# EasyEDA Pro project Type_C硬盘盒_2025-09-27_14-32-02.eprj, board PCB_ver2.0
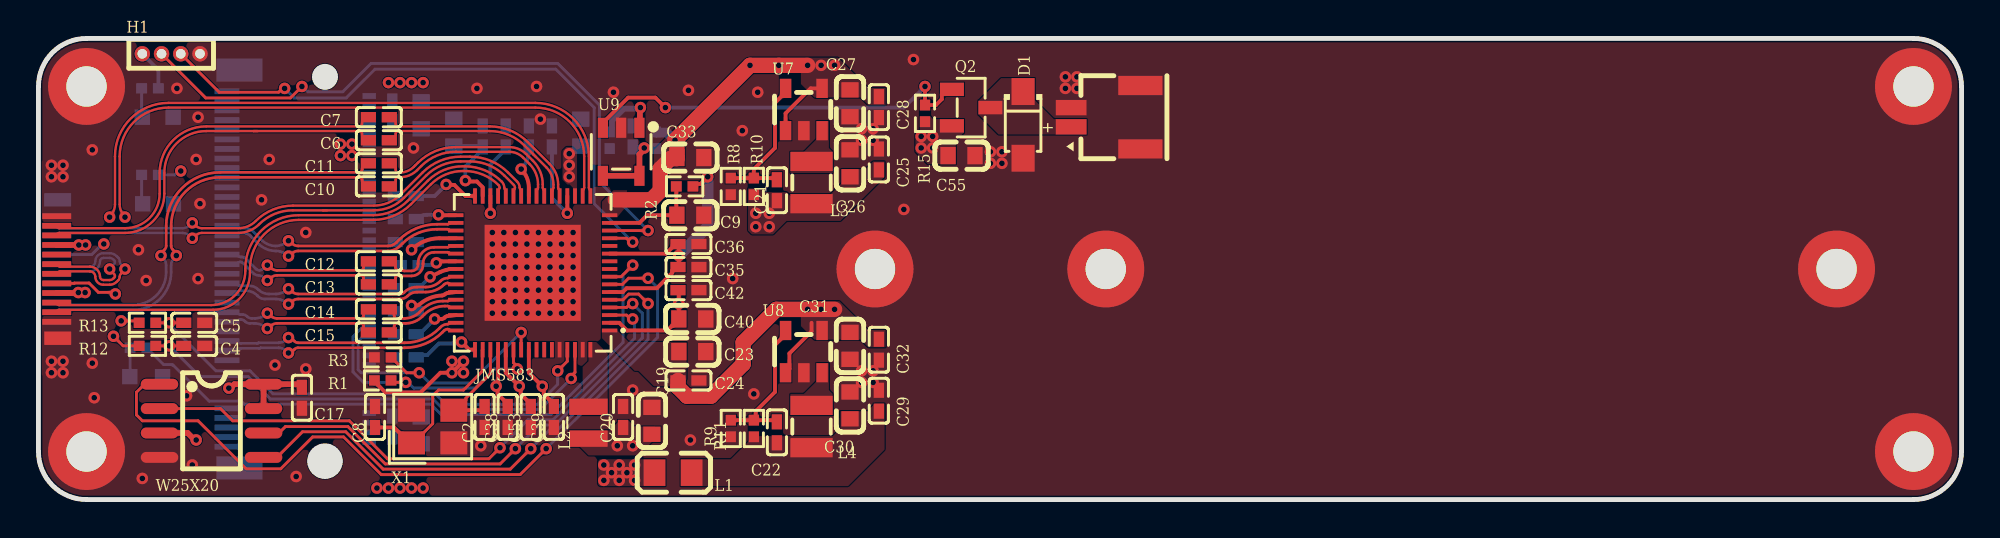
[diagram p5: board, top side]
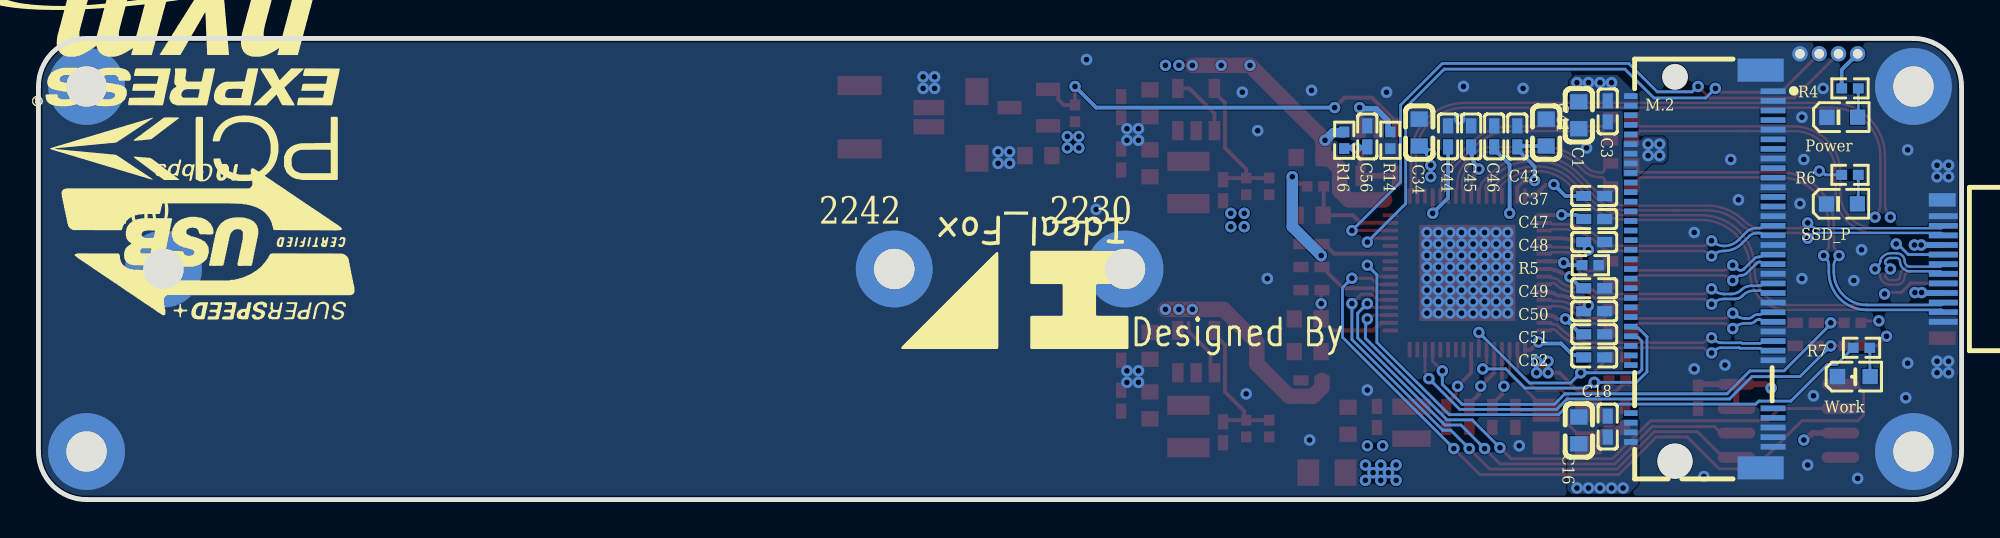
[diagram p6: board, bottom side, seen from below]

Outline 100 x 24 mm; copper layers: Top Layer, GND, VCC, Bottom Layer. Coordinates in mm from the lower left corner of the outline.
Outline path: 0,21.5 arc(0.73,23.27) 2.5,24 97.5,24 arc(99.27,23.27) 100,21.5 100,2.5 arc(99.27,0.73) 97.5,0 2.5,0 arc(0.73,0.73) 0,2.5 0,21.5
Stack: Top Layer 0.035mm / Dielectric 1 0.0711mm PP-006 er 4.1 / GND 0.018mm / Dielectric1 0.32mm FR-4 er 4.8 / VCC 0.018mm / Dielectric 2 0.0711mm PP-006 er 4.1 / Bottom Layer 0.035mm

## Design rules (mm)
net N_P1_TX_P: N_P1_TX
net N_P1_TX_N: N_P1_TX
net N_P0_TX_P: N_P0_TX
net N_P0_TX_N: N_P0_TX
net U_TX2_P: U_TX2
net U_TX2_N: U_TX2
net U_TX1_P: U_TX1
net U_TX1_N: U_TX1
net TX2_P: TX2
net TX2_N: TX2
net TX1_P: TX1
net TX1_N: TX1
net RX2_P: RX2
net RX2_N: RX2
net RX1_P: RX1
net RX1_N: RX1
net P1_TX_P: P1_TX
net P1_TX_N: P1_TX
net P1_RX_P: P1_RX
net P1_RX_N: P1_RX
net P0_TX_P: P0_TX
net P0_TX_N: P0_TX
net P0_RX_P: P0_RX
net P0_RX_N: P0_RX
net D_P: D
net D_N: D
net CLK_P: CLK
net CLK_N: CLK
spacing copperThickness2oz_1: track to track 0.12, other pairs 0 to 0.3
spacing copperThickness1oz_1: track to track 0.12, other pairs 0 to 0.3
spacing copperThickness1oz: track to track 0.12, other pairs 0 to 0.3
spacing Stitching GND: track to track 0.2, other pairs 0 to 0.3
spacing safeClearance (default): track to track 0.12, other pairs 0 to 0.3
track width copperThickness1oz_2 (default): min 0.1, default 0.1, max 5
differential pair DiffPairsRouting_85oum: width min 0.1, default 0.1, max 0.381; gap min 0.1, default 0.1
differential pair DiffPairsRouting_90oum (default): width min 0.1, default 0.1, max 0.381; gap min 0.1, default 0.1
via viaSize (default): diameter min 0.6, default 0.6, max 10; hole min 0.3, default 0.3, max 6.3
net GND uses Stitching GND

## Placement (name value [footprint] x y rotation side)
+  -  [CONN-SMD_2P-P1.00_HX-1.0-2P-WT]  55.5 19.9 90 top
C1  -  [C0603]  19.9 20 270 bottom
C2  -  [C0402]  23.2 4.3 90 top
C3  -  [C0402]  18.4 20.2 90 bottom
C4  -  [C0402]  8.1 8 0 top
C5  -  [C0402]  8.1 9.2 0 top
C6  -  [C0402]  17.7 18.7 0 top
C7  -  [C0402]  17.7 19.9 0 top
C8  -  [C0402]  17.5 4.3 270 top
C9  -  [C0603]  33.9 14.8 180 top
C10  -  [C0402]  17.7 16.3 0 top
C11  -  [C0402]  17.7 17.5 0 top
C12  -  [C0402]  17.7 12.4 180 top
C13  -  [C0402]  17.7 11.2 180 top
C14  -  [C0402]  17.7 9.9 180 top
C15  -  [C0402]  17.7 8.7 180 top
C16  -  [C0603]  19.9 3.6 90 bottom
C17  -  [C0402]  13.7 5.3 90 top
C18  -  [C0402]  18.4 3.8 270 bottom
C19  -  [C0603]  31.9 4.1 270 top
C20  -  [C0402]  30.4 4.3 270 top
C21  -  [C0402]  38.4 16.1 90 top
C22  -  [C0402]  38.4 3.5 90 top
C23  -  [C0603]  34 7.7 180 top
C24  -  [C0402]  33.8 6.2 180 top
C25  -  [C0402]  43.7 17.7 270 top
C26  -  [C0603]  42.2 17.5 270 top
C27  -  [C0603]  42.2 20.62 90 top
C28  -  [C0402]  43.7 20.42 90 top
C29  -  [C0402]  43.7 5.14 270 top
C30  -  [C0603]  42.2 4.9 270 top
C31  -  [C0603]  42.2 8 90 top
C32  -  [C0402]  43.7 7.8 90 top
C33  -  [C0603]  33.9 17.8 180 top
C34  -  [C0603]  28.2 19.1 270 bottom
C35  -  [C0402]  33.8 12.1 180 top
C36  -  [C0402]  33.8 13.3 180 top
C37  -  [C0402]  19.1 15.8 0 bottom
C38  -  [C0402]  24.4 4.3 90 top
C39  -  [C0402]  26.8 4.3 90 top
C40  -  [C0603]  34 9.4 180 top
C41  -  [C0603]  21.6 19.1 270 bottom
C42  -  [C0402]  33.8 10.9 180 top
C43  -  [C0402]  23.1 18.9 270 bottom
C44  -  [C0402]  26.7 18.9 270 bottom
C45  -  [C0402]  25.5 18.9 270 bottom
C46  -  [C0402]  24.3 18.9 270 bottom
C47  -  [C0402]  19.1 14.6 0 bottom
C48  -  [C0402]  19.1 13.4 0 bottom
C49  -  [C0402]  19.1 11 0 bottom
C50  -  [C0402]  19.1 9.8 0 bottom
C51  -  [C0402]  19.1 8.6 0 bottom
C52  -  [C0402]  19.1 7.4 0 bottom
C53  -  [C0402]  25.6 4.3 90 top
C55  -  [C0603]  48 17.9 180 top
C56  -  [C0402]  30.9 18.9 90 bottom
D1  -  [SOD-123FL_L2.7-W1.8-LS3.8-RD]  51.2 19.5 270 top
Designator10  -  [M2_HOLE]  2.5 21.5 0 top
Designator12  -  [M2_HOLE]  43.5 12 0 top
Designator13  -  [M2_HOLE]  55.5 12 0 top
Designator17  -  [M2_HOLE]  97.5 21.5 0 top
Designator18  -  [M2_HOLE]  93.5 12 0 top
Designator19  -  [M2_HOLE]  97.5 2.5 0 top
Designator20  -  [M2_HOLE]  2.5 2.5 0 top
H1  -  [HDR-TH_ZX-PZ1.0-1-4PZZ]  6.9 23.2 0 top
JMS583  -  [QFN-64_L8.0-W8.0-P0.40-TL-EP6.0]  25.7 11.8 180 top
L1  -  [L0805]  33 1.4 180 top
L2  -  [IND-SMD_L2.5-W2.0-VLS252012CX-150M]  28.6 4 90 top
L3  -  [IND-SMD_L2.5-W2.0_MHCHL2520]  40.2 16.5 90 top
L4  -  [IND-SMD_L2.5-W2.0_MHCHL2520]  40.2 3.8 90 top
M.2  -  [CONN-SMD_91302-225-067RCM]  13.5 12 270 bottom
Power  -  [LED0603-RD_GREEN]  6.2 19.9 180 bottom
Q2  -  [SOT-23-3_L2.9-W1.3-P1.90-LS2.4-BR]  48.5 20.4 180 top
R1  -  [R0402]  17.9 6.2 180 top
R2  -  [R0402]  33.6 16.3 180 top
R3  -  [R0402]  17.9 7.4 180 top
R4  -  [R0402]  5.8 21.4 180 bottom
R5  -  [R0402]  19.3 12.2 180 bottom
R6  -  [R0402]  5.8 16.9 180 bottom
R7  -  [R0402]  5.2 7.9 180 bottom
R8  -  [R0402]  36 16.3 90 top
R9  -  [R0402]  36 3.7 90 top
R10  -  [R0402]  37.2 16.3 270 top
R11  -  [R0402]  37.2 3.7 270 top
R12  -  [R0402]  5.67 8 0 top
R13  -  [R0402]  5.67 9.2 0 top
R14  -  [R0402]  29.7 18.7 90 bottom
R15  -  [R0402]  46.1 20.1 90 top
R16  -  [R0402]  32.1 18.7 270 bottom
SSD_P  -  [LED0603-RD_GREEN]  6.22 15.39 180 bottom
U7  -  [SOT-23-5_L2.9-W1.6-P0.95-LS2.8-BL]  39.8 20.3 0 top
U8  -  [SOT-23-5_L2.9-W1.6-P0.95-LS2.8-BL]  39.8 7.7 0 top
U9  -  [SOT-23-5_L3.0-W1.5-P0.95-LS2.8-BL]  30.3 18.1 180 top
USB1  -  [USB-TYPE-C-SMD_U261-241N-4BS60]  0.97 12 90 bottom
W25X20  -  [SOIC-8_L5.0-W4.0-P1.27-LS6.0-BL]  9 4.1 270 top
Work  -  [LED0603-R-RD]  5.6 6.4 180 bottom
X1  -  [CRYSTAL-SMD_4P-L3.2-W2.5-BL]  20.5 3.8 0 top

## Footprints (pads in the part's own frame, mm; a bottom-side part is the same pattern mirrored in y, then rotated)
C0402
  rect 0.79x0.54 smd: 1(-0.545,0) 2(0.545,0)
C0603
  rect 0.8x0.9 smd: 1(-0.7,0) 2(0.7,0)
CONN-SMD_2P-P1.00_HX-1.0-2P-WT
  rect 0.8x1.6 smd: 1(-0.5,1.8) 2(0.5,1.8)
  rect 1x2.3 smd: 3(1.65,-1.8) 4(-1.65,-1.8)
CONN-SMD_91302-225-067RCM
  rect 0.3x1.3 smd: 1(-9.25,3.7) 3(-8.75,3.7) 5(-8.25,3.7) 7(-7.75,3.7) 9(-7.25,3.7) 11(-6.75,3.7) 13(-6.25,3.7) 15(-5.75,3.7) 17(-5.25,3.7) 19(-4.75,3.7) 21(-4.25,3.7) 23(-3.75,3.7) 25(-3.25,3.7) 27(-2.75,3.7) 29(-2.25,3.7) 31(-1.75,3.7) 33(-1.25,3.7) 35(-0.75,3.7) 37(-0.25,3.7) 39(0.25,3.7) 41(0.75,3.7) 43(1.25,3.7) 45(1.75,3.7) 47(2.25,3.7) 49(2.75,3.7) 51(3.25,3.7) 53(3.75,3.7) 55(4.25,3.7) 57(4.75,3.7) 67(7.25,3.7) 69(7.75,3.7) 71(8.25,3.7) 73(8.75,3.7) 75(9.25,3.7)
  rect 0.3x0.7 smd: 2(-9,-3.7) 4(-8.5,-3.7) 6(-8,-3.7) 8(-7.5,-3.7) 10(-7,-3.7) 12(-6.5,-3.7) 14(-6,-3.7) 16(-5.5,-3.7) 18(-5,-3.7) 20(-4.5,-3.7) 22(-4,-3.7) 24(-3.5,-3.7) 26(-3,-3.7) 28(-2.5,-3.7) 30(-2,-3.7) 32(-1.5,-3.7) 34(-1,-3.7) 36(-0.5,-3.7) 38(0,-3.7) 40(0.5,-3.7) 42(1,-3.7) 44(1.5,-3.7) 46(2,-3.7) 48(2.5,-3.7) 50(3,-3.7) 52(3.5,-3.7) 54(4,-3.7) 56(4.5,-3.7) 58(5,-3.7) 68(7.5,-3.7) 70(8,-3.7) 72(8.5,-3.7) 74(9,-3.7)
  rect 1.2x2.4 smd: 76(-10.35,3.05) 77(10.35,3.05)
CRYSTAL-SMD_4P-L3.2-W2.5-BL
  rect 1.4x1.2 smd: 1(-1.1,-0.85) 2(1.1,-0.85) 3(1.1,0.85) 4(-1.1,0.85)
HDR-TH_ZX-PZ1.0-1-4PZZ
  round 0.8 hole 0.5: 1(-1.5,0) 2(-0.5,0) 3(0.5,0) 4(1.5,0)
IND-SMD_L2.5-W2.0-VLS252012CX-150M
  rect 0.85x2 smd: 1(-0.83,0) 2(0.83,0)
IND-SMD_L2.5-W2.0_MHCHL2520
  rect 1x2.2 smd: 1(-1.1,0) 2(1.1,0)
L0805
  rect 1.133x1.377 smd: 1(-0.966,0) 2(0.966,0)
LED0603-R-RD
  rect 0.8x0.8 smd: 1(0.851,0) 2(-0.851,0)
LED0603-RD_GREEN
  rect 0.8x0.8 smd: 1(-0.799,-0.004) 2(0.799,0.004)
M2_HOLE
  round 4 hole 2.1: 16(0,0)
QFN-64_L8.0-W8.0-P0.40-TL-EP6.0
  rect 0.8x0.2 smd: 1(-4,3) 2(-4,2.6) 3(-4,2.2) 4(-4,1.8) 5(-4,1.4) 6(-4,1) 7(-4,0.6) 8(-4,0.2) 9(-4,-0.2) 10(-4,-0.6) 11(-4,-1) 12(-4,-1.4) 13(-4,-1.8) 14(-4,-2.2) 15(-4,-2.6) 16(-4,-3) 33(4,-3) 34(4,-2.6) 35(4,-2.2) 36(4,-1.8) 37(4,-1.4) 38(4,-1) 39(4,-0.6) 40(4,-0.2) 41(4,0.2) 42(4,0.6) 43(4,1) 44(4,1.4) 45(4,1.8) 46(4,2.2) 47(4,2.6) 48(4,3)
  rect 0.2x0.8 smd: 17(-3,-4) 18(-2.6,-4) 19(-2.2,-4) 20(-1.8,-4) 21(-1.4,-4) 22(-1,-4) 23(-0.6,-4) 24(-0.2,-4) 25(0.2,-4) 26(0.6,-4) 27(1,-4) 28(1.4,-4) 29(1.8,-4) 30(2.2,-4) 31(2.6,-4) 32(3,-4) 49(3,4) 50(2.6,4) 51(2.2,4) 52(1.8,4) 53(1.4,4) 54(1,4) 55(0.6,4) 56(0.2,4) 57(-0.2,4) 58(-0.6,4) 59(-1,4) 60(-1.4,4) 61(-1.8,4) 62(-2.2,4) 63(-2.6,4) 64(-3,4)
  rect 5x5 smd: 65(0,0)
R0402
  rect 0.566x0.54 smd: 1(-0.433,0) 2(0.433,0)
SOD-123FL_L2.7-W1.8-LS3.8-RD
  rect 1.4x1.2 smd: 1(-1.735,0) 2(1.735,0)
SOIC-8_L5.0-W4.0-P1.27-LS6.0-BL
  oval 0.569x1.95 smd: 1(-1.905,-2.705) 2(-0.635,-2.705) 3(0.635,-2.705) 4(1.905,-2.705) 5(1.905,2.705) 6(0.635,2.705) 7(-0.635,2.705) 8(-1.905,2.705)
SOT-23-3_L2.9-W1.3-P1.90-LS2.4-BR
  rect 1.25x0.7 smd: 1(1,-0.95) 2(1,0.95) 3(-1,0)
SOT-23-5_L2.9-W1.6-P0.95-LS2.8-BL
  rect 0.6x1 smd: 1(-0.95,-1.1) 2(0,-1.1) 3(0.95,-1.1) 4(0.95,1.1) 5(-0.95,1.1)
SOT-23-5_L3.0-W1.5-P0.95-LS2.8-BL
  rect 0.532x1.045 smd: 1(-0.95,-1.25) 2(0,-1.25) 3(0.95,-1.25) 4(0.95,1.25) 5(-0.95,1.25)
USB-TYPE-C-SMD_U261-241N-4BS60
  rect 0.7x1.4 smd far side: 1(-3.6,0.025)
  rect 0.7x1.4 smd: 2(3.6,0.025)
  rect 0.3x1.5 smd: A1(2.75,-0.025) A2(2.25,-0.025) A3(1.75,-0.025) A4(1.25,-0.025) A5(0.75,-0.025) A6(0.25,-0.025) A7(-0.25,-0.025) A8(-0.75,-0.025) A9(-1.25,-0.025) A10(-1.75,-0.025) A11(-2.25,-0.025) A12(-2.75,-0.025)
  rect 0.3x1.5 smd far side: B1(-2.75,-0.025) B2(-2.25,-0.025) B3(-1.75,-0.025) B4(-1.25,-0.025) B5(-0.75,-0.025) B6(-0.25,-0.025) B7(0.25,-0.025) B8(0.75,-0.025) B9(1.25,-0.025) B10(1.75,-0.025) B11(2.25,-0.025) B12(2.75,-0.025)

## Nets
3V3: C22.1 C29.2 C30.2 L1.1 L4.1 R11.2
AVDDL: C19.2 C20.2 C21.1 C25.2 C26.2 C40.2 C41.2 C42.2 C43.2 C44.2 C45.2 C46.2 C47.2 C48.2 C49.2 C50.2 C51.2 C52.2 C53.2 JMS583.2 JMS583.20 JMS583.25 JMS583.30 JMS583.31 JMS583.33 JMS583.36 JMS583.40 JMS583.43 JMS583.46 JMS583.49 JMS583.53 L2.1 L3.1 R10.2
GND: +.2 +.3 +.4 C1.2 C2.1 C3.1 C4.2 C5.2 C8.1 C9.1 C16.2 C17.1 C18.1 C19.1 C20.1 C23.1 C24.1 C25.1 C26.1 C27.1 C28.1 C29.1 C30.1 C31.1 C32.1 C33.1 C34.1 C35.1 C36.1 C37.1 C38.1 C39.1 C40.1 C41.1 C42.1 C43.1 C44.1 C45.1 C46.1 C47.1 C48.1 C49.1 C50.1 C51.1 C52.1 C53.1 C55.1 C56.2 D1.2 Designator10.16 Designator12.16 Designator13.16 Designator17.16 Designator18.16 Designator19.16 Designator20.16 H1.4 JMS583.60 JMS583.63 JMS583.65 M.2.1 M.2.3 M.2.9 M.2.15 M.2.21 M.2.27 M.2.33 M.2.39 M.2.45 M.2.51 M.2.57 M.2.71 M.2.73 M.2.75 M.2.76 M.2.77 Power.1 R3.2 R5.2 R8.1 R9.1 R14.1 SSD_P.1 U7.2 U8.2 U9.2 USB1.1 USB1.2 USB1.A1 USB1.A12 USB1.B1 USB1.B12 W25X20.4 Work.2 X1.2 X1.4
VBUS: C23.2 C24.2 C27.2 C28.2 C31.2 C32.2 C33.2 C55.2 JMS583.1 JMS583.16 Q2.2 R15.1 R16.1 U7.1 U7.4 U8.1 U8.4 USB1.A4 USB1.A9 USB1.B4 USB1.B9
VCC: C17.2 C34.2 C35.2 C36.2 C37.2 C38.2 C39.2 H1.1 JMS583.6 JMS583.11 JMS583.19 JMS583.32 JMS583.52 JMS583.56 R1.2 R2.1 R4.1 W25X20.3 W25X20.7 W25X20.8
CC1: C4.1 JMS583.62 R12.2
CC2: C5.1 JMS583.61 R13.2
CLK_N: JMS583.47 M.2.53
CLK_P: JMS583.48 M.2.55
D_N: JMS583.17 USB1.A7 USB1.B7
D_P: JMS583.18 USB1.A6 USB1.B6
GPIO0: JMS583.3 W25X20.2
GPIO1: JMS583.4 W25X20.6
GPIO2: JMS583.5 W25X20.5
GPIO3: JMS583.7 W25X20.1
GPIO4: JMS583.8 R7.1
GPIO8: H1.3 JMS583.13
GPIO9: H1.2 JMS583.14
LXO: JMS583.64 L2.2
M.2_3V3: C1.1 C3.2 C16.1 C18.2 L1.2 M.2.2 M.2.4 M.2.12 M.2.14 M.2.16 M.2.18 M.2.70 M.2.72 M.2.74 R6.1
N_P0_TX_N: C14.2 M.2.47
N_P0_TX_P: C15.2 M.2.49
N_P1_TX_N: C12.2 M.2.35
N_P1_TX_P: C13.2 M.2.37
P0_RX_N: JMS583.41 M.2.41
P0_RX_P: JMS583.42 M.2.43
P0_TX_N: C14.1 JMS583.44
P0_TX_P: C15.1 JMS583.45
P1_RX_N: JMS583.34 M.2.29
P1_RX_P: JMS583.35 M.2.31
P1_TX_N: C12.1 JMS583.37
P1_TX_P: C13.1 JMS583.38
PCIE_CLK: JMS583.55 M.2.52 R3.1
PCIE_RST: JMS583.54 M.2.50 R1.1
RST: C9.2 JMS583.15 R2.2
RX1_N: JMS583.27 USB1.A3
RX1_P: JMS583.26 USB1.A2
RX2_N: JMS583.28 USB1.B3
RX2_P: JMS583.29 USB1.B2
TX1_N: C6.2 JMS583.22
TX1_P: C7.2 JMS583.21
TX2_N: C11.2 JMS583.23
TX2_P: C10.2 JMS583.24
U_CC1: R12.1 USB1.A5
U_CC2: R13.1 USB1.B5
U_TX1_N: C6.1 USB1.B10
U_TX1_P: C7.1 USB1.B11
U_TX2_N: C11.1 USB1.A10
U_TX2_P: C10.1 USB1.A11
XIN: C8.2 JMS583.50 X1.1
XOUT: C2.2 JMS583.51 X1.3
$1N3363: R6.2 SSD_P.2
$1N3561: R7.2 Work.1
$1N4495: JMS583.39 R5.1
$1N10279: C22.2 R9.2 R11.1 U8.5
$1N10317: L4.2 U8.3
$1N10953: Power.2 R4.2
$1N11538: L3.2 U7.3
$1N11540: C21.2 R8.2 R10.1 U7.5
$1N22897: R14.2 U9.1
$1N22946: C56.1 R16.2 U9.4 U9.5
$1N23051: Q2.1 R15.2 U9.3
$1N23334: +.1 D1.1 Q2.3

Pads without a net: JMS583 9 10 12 57 58 59; M.2 5 6 7 8 10 11 13 17 19 20 22 23 24 25 26 28 30 32 34 36 38 40 42 44 46 48 54 56 58 67 68 69; USB1 A8 B8

## Via types
v1: diameter 0.6, hole 0.3, Top Layer to Bottom Layer, 241 vias

## Routing (per net, layer and track width the routed paths; a pad name or vN(x,y) marks a point on that pad's centre or on a via; arc(x,y) is an arc through that point)
AVDDL: length 97.1
  Top Layer w0.2: v1(19.4,10.1) 19.67,10.1 arc(19.75,10.11) 19.81,10.15 arc(20.36,10.49) 20.99,10.62 arc(21.06,10.64) 21.12,10.68 arc(21.19,10.72) 21.27,10.75 JMS583.43 ; JMS583.31 23.1,16.25 22.8,16.55 22.25,16.55 v1(22.2,16.6) ; v1(23.5,14.9) JMS583.30 ; JMS583.2 30.2,9.2 30.6,8.8 32.7,8.8 32.95,9.05 33,9.05 33.3,9.35 C40.2 33.3,10.86 C42.2 ; v1(27.5,14.9) JMS583.20 ; JMS583.40 21.4,12 21.2,11.95 arc(21.03,11.9) 20.87,11.83 v1(20.36,11.59) ; v1(20.6,9.4) 20.97,9.4 arc(21.05,9.42) 21.11,9.47 arc(21.18,9.52) 21.27,9.55 JMS583.46 ; v1(20.8,14.82) 20.8,14.8 JMS583.33 ; C53.2 25.6,4.97 25.08,5.49 25.08,5.82 v1(25,5.9) 24.3,6.6 JMS583.53 ; JMS583.36 20.85,13.6 arc(20.06,13.44) v1(19.4,13) ; v1(22,8.2) 22.4,7.8 JMS583.49 ; JMS583.25 25.5,16.23 arc(25.4,16.76) v1(25.1,17.2)
  VCC w0.6: v1(25,5.9) 25.18,6.08 25.2,6.08 25.62,6.5 25.62,7.1 25.2,7.52 23.38,7.52 22,8.9 v1(22,8.2)
  VCC w0.8: v1(19.4,10.1) 20.15,10.85 20.25,10.85 ; 25.2,15.22 25.1,15.32 v1(25.1,17.2) ; v1(33.3,10.2) 35.15,8.35 35.15,8.25 ; v1(22.2,16.6) 22.2,15.56 22.78,14.98 ; 19.35,11.75 19.51,11.59 ; v1(20.6,9.4) 21.15,9.95 ; v1(30.1,2.8) v1(30.9,2.8)
  VCC w1.5: 37.6,14.7 37.6,10.7 30.5,3.6
  VCC w1.8: 19.35,11.75 19.35,12.95 ; 19.51,11.59 22,9.1 22,8.9 ; 37.6,14.7 34.69,14.7 34.07,15.32 28.27,15.32 28.17,15.22 23.02,15.22 22.78,14.98 20.96,14.98 v1(20.8,14.82) 20.62,14.82 19.4,13.6 v1(19.4,13)
  Bottom Layer w0.2: v1(20.6,9.4) 19.91,8.71 arc(19.79,8.63) C51.2 ; C52.2 19.76,7.52 20.22,7.52 20.82,8.12 21.92,8.12 v1(22,8.2) ; v1(27.5,14.9) 26.7,15.7 C44.2 ; C45.2 25.5,18.17 arc(25.4,17.64) v1(25.1,17.2) ; v1(20.8,14.82) 20.18,14.82 arc(19.89,14.76) C47.2 ; C48.2 19.51,13.26 arc(19.43,13.14) v1(19.4,13) ; v1(23.5,14.9) 23.5,17.43 24.3,18.23 C46.2 ; v1(20.36,11.59) 19.86,11.09 arc(19.76,11.02) C49.2 ; 23.06,18.4 C43.2 ; 23.06,18.4 23.06,18.19 22.2,17.33 v1(22.2,16.6) ; 23.06,18.4 C41.2
  vias: v1(37.3,14.9) v1(37.3,14.2) v1(38,14.9) v1(38,14.2)
GND:
  vias: v1(0.67,17.4) v1(0.67,16.8) v1(0.67,7.2) v1(0.67,6.6) v1(1.28,17.4) v1(1.28,16.8) v1(1.28,7.2) v1(1.28,6.6) v1(2.8,18.2) v1(2.8,7.1) v1(2.9,5.3) v1(5.2,13) v1(5.4,1.1) v1(5.6,11.4) v1(7.2,21.4) v1(7.7,5.4) v1(8,1.8) v1(8.2,17.7) v1(8.3,19.9) v1(8.3,11.5) v1(8.4,15.4) v1(11.6,15.6) v1(12,17.7) v1(12.3,7) v1(13.4,1.2) v1(13.9,13.9) v1(13.9,6.8) v1(19.5,18.3) v1(22.8,21.4) v1(23,2.8) v1(23.6,13.9) v1(23.6,13.3) v1(23.6,12.7) v1(23.6,12.1) v1(23.6,11.5) v1(23.6,10.9) v1(23.6,10.3) v1(23.6,9.7) v1(24.2,13.9) v1(24.2,13.3) v1(24.2,12.7) v1(24.2,12.1) v1(24.2,11.5) v1(24.2,10.9) v1(24.2,10.3) v1(24.2,9.7) v1(24.8,13.9) v1(24.8,13.3) v1(24.8,12.7) v1(24.8,12.1) v1(24.8,11.5) v1(24.8,10.9) v1(24.8,10.3) v1(24.8,9.7) v1(25.4,13.9) v1(25.4,13.3) v1(25.4,12.7) v1(25.4,12.1) v1(25.4,11.5) v1(25.4,10.9) v1(25.4,10.3) v1(25.4,9.7) v1(25.9,21.5) v1(26,13.9) v1(26,13.3) v1(26,12.7) v1(26,12.1) v1(26,11.5) v1(26,10.9) v1(26,10.3) v1(26,9.7) v1(26.1,19.8) v1(26.6,13.9) v1(26.6,13.3) v1(26.6,12.7) v1(26.6,12.1) v1(26.6,11.5) v1(26.6,10.9) v1(26.6,10.3) v1(26.6,9.7) v1(27.2,13.9) v1(27.2,13.3) v1(27.2,12.7) v1(27.2,12.1) v1(27.2,11.5) v1(27.2,10.9) v1(27.2,10.3) v1(27.2,9.7) v1(27.8,13.9) v1(27.8,13.3) v1(27.8,12.7) v1(27.8,12.1) v1(27.8,11.5) v1(27.8,10.9) v1(27.8,10.3) v1(27.8,9.7) v1(29.9,21.2) v1(30.9,5.7) v1(33.8,21.3) v1(33.9,3.1) v1(36.1,11.5) v1(36.6,19.2) v1(37.2,5.5) v1(37.4,21.2) v1(42.8,19.3) v1(42.8,18.7) v1(42.8,6.7) v1(42.8,6.1) v1(43.4,19.3) v1(43.4,18.7) v1(43.4,6.7) v1(43.4,6.1) v1(45,15.1) v1(45.5,22.9) v1(49.5,18.1) v1(49.5,17.5) v1(50.1,18.1) v1(50.1,17.5) v1(53.4,22) v1(53.4,21.4) v1(54,22) v1(54,21.4)
VBUS: length 106.6
  Top Layer w0.2: U7.1 38.85,20.1 40.15,21.4 U7.4 ; U8.1 39.05,6.8 39.05,7.6 40.2,8.75 40.2,9.2
  Top Layer w0.3: USB1.A9 2.4,10.75 v1(2.42,10.78) ; v1(2.45,13.25) v1(2.1,13.25) USB1.A4
  Top Layer w0.8: v1(40,22.6) v1(38.5,22.6) v1(37,22.6) v1(33.1,18.7) 33.2,18.6 33.2,17.85 ; C33.2 33.2,17.75 32.87,17.75 32.33,17.22 32.33,16.07 31.87,15.6 30,15.6 ; C24.2 33.25,5.85 33.72,5.38 34.97,5.38 36.65,7.06 36.65,8.17 38.37,9.9 v1(40,9.9) v1(40.7,9.9) v1(41.4,9.9)
  VCC w1.3: v1(2.08,10.78) 2.35,11.05 2.35,13 v1(2.1,13.25) ; 2.08,13.25 2.08,14.69 6.19,18.8 13.67,18.8 17.77,22.9 29.43,22.9 29.73,22.6 v1(37,22.6) 41.4,22.6
  VCC w1.5: v1(41.4,22.6) v1(40.7,22.6) ; v1(41.4,22.6) 42.2,22.6 v1(45.9,18.9) 46.2,18.6 ; v1(41.4,22.6) 41.75,22.6
  VCC w2: 40.7,22.6 40.7,14.05 40.3,13.65 40.3,10.3 40.7,9.9
  Bottom Layer w0.3: v1(2.42,10.78) 2.4,10.75 USB1.A9 ; USB1.A4 v1(2.1,13.25) v1(2.45,13.25)
  Bottom Layer w0.5: v1(33.1,18.7) 33.07,18.7 32.67,19.1 32.12,19.1 32.1,19.12 32.1,19.13
  vias: v1(45.9,18.3) v1(46.5,18.9) v1(46.5,18.3)
VCC: length 121.7
  Top Layer w0.2: C39.2 26.8,4.97 26.28,5.49 26.28,5.82 v1(26.2,5.9) 25.5,6.6 JMS583.56 ; C38.2 24.4,4.97 23.88,5.49 23.88,5.82 v1(23.8,5.9) 23.8,6.01 23.9,6.11 JMS583.52 ; R1.2 17.48,6.2 17.65,6.03 17.65,5.96 18.03,5.58 19.88,5.58 20.9,6.6 v1(21.5,6.6) v1(22.1,7.2) ; R2.1 34.16,16.43 34.43,16.43 v1(34.8,16.8) ; JMS583.11 32.63,12.8 33.13,13.3 C36.2 33.3,13.25 v1(33.3,12.7) 33.3,12.14 C35.2 33.13,12.1 32.96,11.93 32.96,11.81 32.16,11 30.58,11 30.38,10.8 JMS583.6 ; v1(21.2,16.4) 21.22,16.38 21.62,16.38 22.2,15.8 JMS583.32
  Top Layer w0.3: W25X20.8 13.58,6 13.7,5.89 C17.2 ; W25X20.8 10.19,6 9.98,5.8 v1(9.9,5.8) ; W25X20.8 W25X20.7 ; v1(8.2,3.1) 8.12,3.1 7.76,3.47 W25X20.3
  GND w0.8: 10.42,5.28 8.24,3.1 v1(8.2,3.1) ; 10.42,5.28 v1(9.9,5.8) ; 10.42,5.28 20.18,5.28 v1(21.5,6.6) v1(22.1,7.2)
  VCC w0.3: 5.4,23.2 5.4,19.31 1.16,15.07 1.16,10.14 v1(8.2,3.1)
  VCC w0.8: v1(22.1,6.6) 23.62,5.08 ; 23.62,5.08 23.62,5.72 v1(23.8,5.9) ; 23.62,5.08 25.38,5.08 v1(26.2,5.9) ; v1(27.6,17.4) 34.2,17.4 v1(34.8,16.8) ; 20.25,17.35 v1(21.2,16.4)
  VCC w1: v1(27.6,16.8) v1(27.6,17.4) v1(27.6,18)
  VCC w1.5: v1(27.6,17.4) 26.53,18.47 21.36,18.47 17.2,14.31 17.2,9.7 19.13,7.77 20.28,7.77 21.02,7.03 21.67,7.03 21.8,6.9
  Bottom Layer w0.2: v1(21.2,16.4) 20.6,15.8 C37.2 ; H1.1 6.23,22.37 R4.1 ; 27.71,18 27.81,18.1 27.9,18.1 C34.2 arc(28.02,18.36) 27.86,18.26 v1(27.6,18) 27.71,18
  Bottom Layer w0.6: v1(33.3,12.7) 34.8,14.2 v1(34.8,16.8)
  vias: v1(21.5,7.2)
CC1: length 26
  Top Layer w0.15: v1(27.7,6.3) 27.7,6.42 27.9,6.62 JMS583.62 ; R12.2 v1(6.8,8) 7.56,8
  Bottom Layer w0.15: v1(27.7,6.3) 26.09,4.69 21.06,4.69 20.52,5.23 12.06,5.23 10.9,6.4 8.4,6.4 v1(6.8,8)
CC2: length 25.9
  Top Layer w0.15: v1(27,6.7) 27.5,7.2 JMS583.61 ; R13.2 v1(6.8,9.2) 7.56,9.2
  Bottom Layer w0.15: v1(27,6.7) 27,6 25.96,4.96 21.17,4.96 20.63,5.5 12.19,5.5 11,6.7 9.23,6.7 6.8,9.13 v1(6.8,9.2)
CLK_N: length 12.4
  Top Layer w0.14: JMS583.47 21.45,9.2 arc(21.4,9.19) 21.36,9.17 arc(21.33,9.14) 21.28,9.13 arc(21.08,9.09) 20.91,8.98 20.84,8.9 arc(20.01,8.35) 19.04,8.16 13.5,8.16 arc(13.4,8.18) 13.32,8.23 13.21,8.34 arc(13.12,8.41) v1(13,8.43)
  Bottom Layer w0.14: M.2.53 10.22,8.25 arc(10.29,8.23) 10.36,8.19 arc(10.43,8.15) 10.5,8.13 11.39,8.13 arc(11.41,8.13) 11.42,8.14 arc(11.44,8.16) 11.46,8.16 12.5,8.16 arc(12.67,8.2) 12.82,8.3 12.93,8.4 arc(12.96,8.42) v1(13,8.43)
CLK_P: length 12.4
  Top Layer w0.14: JMS583.48 21.45,8.8 arc(21.4,8.81) 21.36,8.83 arc(21.33,8.86) 21.28,8.87 arc(21.18,8.85) 21.1,8.79 21.02,8.72 arc(20.11,8.11) 19.04,7.9 13.5,7.9 arc(13.4,7.88) 13.32,7.83 13.21,7.72 arc(13.11,7.65) v1(13,7.63)
  Bottom Layer w0.14: M.2.55 10.22,7.75 arc(10.29,7.77) 10.36,7.81 arc(10.43,7.85) 10.5,7.87 11.49,7.87 arc(11.51,7.87) 11.53,7.89 arc(11.55,7.9) 11.57,7.9 12.5,7.9 arc(12.67,7.86) 12.82,7.77 12.93,7.66 arc(12.96,7.64) v1(13,7.63)
D_N: length 44
  Top Layer w0.125: JMS583.17 28.7,16.05 arc(28.69,16.1) 28.66,16.14 arc(28.63,16.18) 28.62,16.23 28.62,17.86 arc(27.81,19.83) 25.84,20.64 6.76,20.64 arc(4.79,19.83) 3.98,17.86 3.98,15.37 arc(3.91,15.04) 3.72,14.75 arc(3.71,14.73) v1(3.7,14.7) ; v1(3.7,12) arc(3.71,11.97) 3.72,11.95 3.94,11.73 arc(3.97,11.69) 3.98,11.64 arc(3.97,11.59) 3.94,11.55 3.9,11.51 arc(3.81,11.45) 3.7,11.42 3.38,11.42 arc(3.25,11.48) 3.2,11.6 arc(3.05,11.97) 2.68,12.12 1.13,12.12 arc(1.04,12.16) 1,12.25
  VCC w0.125: v1(3.7,14.7) arc(3.71,14.67) 3.72,14.65 3.84,14.53 arc(3.94,14.38) 3.98,14.2 3.98,12.67 arc(3.91,12.34) 3.72,12.05 arc(3.71,12.03) v1(3.7,12)
  Bottom Layer w0.125: v1(3.7,12) arc(3.71,12.03) 3.72,12.05 3.94,12.27 arc(3.97,12.31) 3.98,12.36 arc(3.97,12.41) 3.94,12.45 3.9,12.49 arc(3.81,12.55) 3.7,12.58 3.38,12.58 arc(3.25,12.52) 3.2,12.4 arc(3.05,12.03) 2.68,11.88 1.13,11.88 arc(1.04,11.84) 1,11.75
D_P: length 44
  Top Layer w0.125: JMS583.18 28.3,16.05 arc(28.31,16.1) 28.34,16.14 arc(28.37,16.18) 28.38,16.23 28.38,17.86 arc(27.63,19.66) 25.84,20.4 6.76,20.4 arc(4.97,19.66) 4.22,17.86 4.22,15.37 arc(4.29,15.04) 4.48,14.75 arc(4.49,14.73) v1(4.5,14.7) ; v1(4.5,12) arc(4.49,11.97) 4.48,11.95 4.3,11.76 arc(4.24,11.68) 4.22,11.59 arc(4.2,11.49) 4.15,11.41 4.07,11.33 arc(3.9,11.22) 3.7,11.18 3.38,11.18 arc(3.08,11.3) 2.95,11.6 arc(2.87,11.8) 2.68,11.88 1.13,11.88 arc(1.04,11.84) 1,11.75
  VCC w0.125: v1(4.5,14.7) arc(4.49,14.67) 4.48,14.65 4.36,14.53 arc(4.26,14.38) 4.22,14.2 4.22,12.67 arc(4.29,12.34) 4.48,12.05 arc(4.49,12.03) v1(4.5,12)
  Bottom Layer w0.125: v1(4.5,12) arc(4.49,12.03) 4.48,12.05 4.3,12.24 arc(4.24,12.32) 4.22,12.41 arc(4.2,12.51) 4.15,12.59 4.07,12.67 arc(3.9,12.78) 3.7,12.82 3.38,12.82 arc(3.08,12.7) 2.95,12.4 arc(2.87,12.2) 2.68,12.12 1.13,12.12 arc(1.04,12.16) 1,12.25
GPIO0: length 30.7
  Top Layer w0.15: v1(30.9,9.4) 30.78,9.4 30.58,9.6 JMS583.3 ; v1(24,2.7) 23.42,2.12 18.15,2.12 16.17,4.1 10.1,4.1 9.47,4.73 W25X20.2
  Bottom Layer w0.15: v1(24,2.7) 25.45,4.15 26.75,4.15 31,8.4 31,8.88 30.99,8.89 30.99,9.31 v1(30.9,9.4)
GPIO1: length 26.6
  Top Layer w0.15: W25X20.6 12.51,3.47 12.84,3.8 16.09,3.8 18.03,1.86 24,1.86 v1(24.8,2.65) ; v1(30.9,10.2) 30.78,10.2 30.58,10 JMS583.4
  Bottom Layer w0.15: v1(24.8,2.65) 26.03,3.88 26.87,3.88 31.4,8.41 31.4,9.7 v1(30.9,10.2)
GPIO2: length 28.3
  Top Layer w0.15: W25X20.5 12.4,2.19 13.73,3.53 15.98,3.53 17.92,1.58 24.53,1.58 v1(25.6,2.65) ; JMS583.5 30.4,10.4 30.69,10.69 31.21,10.69 v1(31.7,10.2)
  Bottom Layer w0.15: v1(31.7,10.2) 31.7,8.33 26.98,3.61 26.56,3.61 v1(25.6,2.65)
GPIO3: length 40.7
  Top Layer w0.15: v1(26.4,2.65) 25.05,1.3 17.83,1.3 15.87,3.26 14.26,3.26 12.6,1.6 10.8,1.6 8.3,4.1 5.4,4.1 5.09,4.41 5.09,5.58 5.52,6 W25X20.1 ; v1(31.7,11.52) 30.69,11.52 30.37,11.2 JMS583.7
  Bottom Layer w0.15: 31.71,11.52 32.19,11.03 32.19,8.44 v1(26.4,2.65)
GPIO4: length 33.4
  Top Layer w0.15: v1(30.9,12.2) 30.3,11.6 JMS583.8
  Bottom Layer w0.15: v1(30.9,12.2) 30.4,11.7 30.4,8.18 26.64,4.42 20.95,4.42 20.4,4.97 10.7,4.97 10.54,5.12 8.88,5.12 7,7 6.97,7 6.94,7.03 6.51,7.03 5.63,7.9
GPIO8: length 33.2
  Top Layer w0.15: JMS583.13 30.58,13.6 30.78,13.4 v1(30.9,13.4) ; v1(12.8,21.4) 12.69,21.4 12.49,21.2 9.4,21.2 H1.3
  Bottom Layer w0.15: v1(30.9,13.4) 28.9,15.4 28.9,20.4 26.9,22.4 17.5,22.4 16,20.9 13.3,20.9 v1(12.8,21.4)
GPIO9: length 35.2
  Top Layer w0.15: H1.2 8.7,20.9 13.1,20.9 v1(13.7,21.5) ; JMS583.14 v1(31.7,14)
  Bottom Layer w0.15: v1(13.7,21.5) 13.74,21.5 14.01,21.22 15.82,21.22 17.3,22.7 27,22.7 29.17,20.53 29.17,16.53 v1(31.7,14)
M.2_3V3: length 9.5
  VCC w0.15: 15.4,17.7 14.8,17.1 v1(7.4,17.1)
  Bottom Layer w0.15: v1(7.4,17.1) 7.28,17.1 7.08,16.9 R6.1
  vias: v1(15.7,18.5) v1(15.7,17.9) v1(16.3,18.5) v1(16.3,17.9) v1(17.6,0.6) v1(18.2,21.7) v1(18.2,0.6) v1(18.8,21.7) v1(18.8,0.6) v1(19.4,21.7) v1(19.4,0.6) v1(20,21.7) v1(20,0.6) v1(29.4,1.8) v1(29.4,1) v1(29.8,1.4) v1(30.2,1.8) v1(30.2,1) v1(30.6,1.4) v1(31,1.8) v1(31,1)
N_P0_TX_N: length 7.9
  Top Layer w0.14: C14.2 arc(17.11,9.89) 17.06,9.86 16.97,9.77 arc(16.92,9.69) 16.9,9.61 16.9,9.57 arc(16.89,9.52) 16.86,9.47 arc(16.82,9.44) 16.76,9.43 12.4,9.43 arc(12.23,9.47) 12.08,9.56 11.97,9.67 arc(11.94,9.69) v1(11.9,9.7)
  Bottom Layer w0.14: M.2.47 10.22,9.75 arc(10.29,9.73) 10.36,9.69 arc(10.43,9.65) 10.5,9.63 10.61,9.63 arc(10.74,9.6) 10.85,9.53 arc(10.96,9.46) 11.09,9.43 11.27,9.43 arc(11.56,9.49) 11.81,9.65 11.83,9.67 arc(11.86,9.69) v1(11.9,9.7)
N_P0_TX_P: length 7.9
  Top Layer w0.14: v1(11.9,8.9) arc(11.94,8.91) 11.97,8.93 12.08,9.03 arc(12.23,9.13) 12.4,9.17 16.76,9.17 arc(16.82,9.16) 16.86,9.13 arc(16.89,9.08) 16.9,9.03 16.9,8.99 arc(16.92,8.91) 16.97,8.83 17.06,8.74 arc(17.11,8.71) C15.2
  Bottom Layer w0.14: M.2.49 10.22,9.25 arc(10.29,9.27) 10.36,9.31 arc(10.43,9.35) 10.5,9.37 10.53,9.37 arc(10.64,9.35) 10.72,9.29 10.75,9.27 arc(10.86,9.2) 10.99,9.17 11.25,9.17 arc(11.56,9.11) 11.83,8.93 arc(11.86,8.91) v1(11.9,8.9)
N_P1_TX_N: length 8.1
  Top Layer w0.14: C12.2 arc(17.11,12.39) 17.06,12.36 16.97,12.27 arc(16.92,12.19) 16.9,12.11 16.9,12.07 arc(16.89,12.02) 16.86,11.97 arc(16.82,11.94) 16.76,11.93 12.4,11.93 arc(12.23,11.97) 12.08,12.06 11.97,12.17 arc(11.94,12.19) v1(11.9,12.2)
  Bottom Layer w0.14: M.2.35 10.22,12.75 arc(10.29,12.73) 10.36,12.69 arc(10.43,12.65) 10.5,12.63 10.55,12.63 arc(10.68,12.61) 10.78,12.54 11.31,12 arc(11.39,11.95) 11.49,11.93 arc(11.58,11.95) 11.66,12 11.83,12.17 arc(11.86,12.19) v1(11.9,12.2)
N_P1_TX_P: length 8.1
  Top Layer w0.14: C13.2 arc(17.11,11.21) 17.06,11.24 16.97,11.33 arc(16.92,11.41) 16.9,11.49 16.9,11.53 arc(16.89,11.58) 16.86,11.63 arc(16.82,11.66) 16.76,11.67 12.4,11.67 arc(12.23,11.63) 12.08,11.53 11.97,11.43 arc(11.94,11.41) v1(11.9,11.4)
  Bottom Layer w0.14: M.2.37 10.21,12.25 arc(10.29,12.27) 10.36,12.31 arc(10.43,12.36) 10.5,12.37 arc(10.57,12.36) 10.63,12.31 11.17,11.78 arc(11.29,11.7) 11.43,11.67 arc(11.58,11.64) 11.7,11.56 11.83,11.43 arc(11.86,11.41) v1(11.9,11.4)
P0_RX_N: length 12.4
  Top Layer w0.14: JMS583.41 21.45,11.6 arc(21.4,11.59) 21.36,11.56 arc(21.33,11.54) 21.28,11.53 arc(21.08,11.49) 20.91,11.38 arc(20.56,11.14) 20.15,11.06 19.68,11.06 arc(19.32,10.99) 19.02,10.78 arc(18.92,10.72) 18.81,10.7 13.5,10.7 arc(13.33,10.74) 13.18,10.83 13.07,10.94 arc(13.04,10.96) v1(13,10.97)
  Bottom Layer w0.14: M.2.41 10.22,11.25 arc(10.29,11.23) 10.36,11.19 arc(10.43,11.15) 10.5,11.13 10.93,11.13 arc(11.21,11.07) 11.45,10.92 arc(11.69,10.76) 11.97,10.7 12.35,10.7 arc(12.66,10.76) 12.93,10.94 arc(12.96,10.96) v1(13,10.97)
P0_RX_P: length 12.4
  Top Layer w0.14: 18.42,10.44 18.81,10.44 arc(19.02,10.48) 19.2,10.6 arc(19.42,10.75) 19.68,10.8 20.15,10.8 arc(20.66,10.9) 21.1,11.19 arc(21.18,11.25) 21.28,11.27 arc(21.33,11.26) 21.36,11.23 arc(21.4,11.21) 21.45,11.2 JMS583.42 ; 18.41,10.44 13.5,10.44 arc(13.33,10.4) 13.18,10.31 13.07,10.2 arc(13.04,10.18) v1(13,10.17)
  Bottom Layer w0.14: M.2.43 10.22,10.75 arc(10.29,10.77) 10.36,10.81 arc(10.43,10.85) 10.5,10.87 10.77,10.87 arc(11.1,10.8) 11.38,10.62 11.41,10.59 arc(11.57,10.48) 11.77,10.44 12.35,10.44 arc(12.66,10.38) 12.93,10.2 arc(12.96,10.18) v1(13,10.17)
P0_TX_N: length 4
  Top Layer w0.14: JMS583.44 21.45,10.4 arc(21.4,10.39) 21.36,10.36 arc(21.33,10.34) 21.28,10.33 21.03,10.33 arc(20.44,10.21) 19.94,9.88 19.81,9.75 arc(19.46,9.51) 19.04,9.43 18.64,9.43 arc(18.58,9.44) 18.54,9.47 arc(18.51,9.52) 18.5,9.57 arc(18.47,9.69) 18.41,9.79 18.34,9.86 arc(18.29,9.89) C14.1
P0_TX_P: length 4
  Top Layer w0.14: JMS583.45 21.45,10 arc(21.4,10.01) 21.36,10.03 arc(21.33,10.06) 21.28,10.07 21.14,10.07 arc(20.55,9.95) 20.05,9.62 19.96,9.53 arc(19.56,9.26) 19.09,9.17 18.64,9.17 arc(18.58,9.16) 18.54,9.13 arc(18.51,9.08) 18.5,9.03 arc(18.47,8.91) 18.41,8.81 18.34,8.74 arc(18.29,8.71) C15.1
P1_RX_N: length 12.7
  Top Layer w0.14: JMS583.34 21.45,14.4 arc(21.4,14.39) 21.36,14.36 arc(21.33,14.34) 21.28,14.33 20.72,14.33 arc(19.65,14.12) 18.74,13.51 18.62,13.38 arc(18.41,13.25) 18.17,13.2 13.5,13.2 arc(13.33,13.24) 13.18,13.33 13.07,13.44 arc(13.04,13.46) v1(13,13.47)
  Bottom Layer w0.14: M.2.29 10.22,14.25 arc(10.29,14.23) 10.36,14.19 arc(10.43,14.15) 10.5,14.13 10.7,14.13 arc(10.96,14.08) 11.19,13.93 11.61,13.51 arc(11.95,13.28) 12.35,13.2 arc(12.66,13.26) 12.93,13.44 arc(12.96,13.46) v1(13,13.47)
P1_RX_P: length 12.7
  Top Layer w0.14: JMS583.35 21.45,14 arc(21.4,14.01) 21.36,14.03 arc(21.33,14.06) 21.28,14.07 20.72,14.07 arc(19.75,13.88) 18.93,13.33 18.8,13.2 arc(18.51,13.01) 18.17,12.94 13.5,12.94 arc(13.33,12.9) 13.18,12.81 13.07,12.7 arc(13.04,12.68) v1(13,12.67)
  Bottom Layer w0.14: M.2.31 10.22,13.75 arc(10.29,13.77) 10.36,13.81 arc(10.43,13.85) 10.5,13.87 10.65,13.87 arc(10.86,13.83) 11.04,13.71 11.43,13.32 arc(11.85,13.04) 12.35,12.94 arc(12.66,12.88) 12.93,12.7 arc(12.96,12.68) v1(13,12.67)
P1_TX_N: length 4.5
  Top Layer w0.14: JMS583.37 21.45,13.2 arc(21.4,13.19) 21.36,13.17 arc(21.33,13.14) 21.28,13.13 20.57,13.13 arc(19.98,12.89) 19.74,12.3 19.74,12.24 arc(19.64,12) 19.4,11.9 19.01,11.9 arc(18.99,11.9) 18.97,11.92 arc(18.96,11.93) 18.94,11.93 18.71,11.93 arc(18.66,11.94) 18.61,11.97 arc(18.58,12.02) 18.57,12.07 arc(18.55,12.19) 18.48,12.29 18.46,12.31 arc(18.36,12.38) C12.1
P1_TX_P: length 4.5
  Top Layer w0.14: JMS583.38 21.45,12.8 arc(21.4,12.81) 21.36,12.83 arc(21.33,12.86) 21.28,12.87 20.57,12.87 arc(20.17,12.7) 20,12.3 20,12.24 arc(19.82,11.82) 19.4,11.64 18.9,11.64 arc(18.88,11.64) 18.86,11.66 arc(18.85,11.67) 18.83,11.67 18.71,11.67 arc(18.66,11.66) 18.61,11.63 arc(18.58,11.58) 18.57,11.53 arc(18.55,11.41) 18.48,11.31 18.46,11.29 arc(18.36,11.22) C13.1
PCIE_CLK: length 14.7
  Top Layer w0.15: JMS583.55 v1(25.1,8.7) ; v1(19.8,6.6) 19.15,6.6 18.35,7.4 18.33,7.4
  Bottom Layer w0.15: M.2.52 17.12,8.42 16.81,8.42 16.62,8.24 16.62,6.76 16.78,6.6 v1(19.8,6.6) 20.33,6.07 22.47,6.07 v1(25.1,8.7)
PCIE_RST: length 14.1
  Top Layer w0.15: v1(19.1,6.1) 18.43,6.1 18.33,6.2 ; JMS583.54 24.7,7.12 24.9,6.92 v1(24.9,6.8)
  Bottom Layer w0.15: v1(24.9,6.8) 23.7,6.8 22.7,5.8 19.52,5.8 19.22,6.1 16.9,6.1 16.36,6.64 16.36,8.47 16.81,8.92 17.12,8.92 M.2.50
RST: length 5.2
  Top Layer w0.2: R2.2 33.17,14.83 C9.2 31.65,14.8 31.25,14.4 JMS583.15
RX1_N: length 26.4
  Top Layer w0.125: 14.8,15.06 15,15.06 ; 14.8,15.06 17.44,15.06 arc(18.29,15.22) 19,15.7 20.16,16.86 arc(20.98,17.41) 21.95,17.6 22.44,17.6 arc(23.41,17.41) 24.24,16.86 24.72,16.37 arc(24.76,16.31) 24.78,16.23 arc(24.77,16.18) 24.74,16.14 arc(24.71,16.1) 24.7,16.05 JMS583.27 ; 14.8,15.06 13.23,15.06 arc(12.28,14.87) 11.47,14.33 arc(10.98,13.99) 10.39,13.88 8.5,13.88 arc(8.32,13.84) 8.17,13.74 8.05,13.62 arc(8.03,13.61) v1(8,13.6)
  Bottom Layer w0.125: v1(8,13.6) arc(7.97,13.61) 7.95,13.62 7.83,13.74 arc(7.68,13.84) 7.5,13.88 1.08,13.88 arc(0.99,13.84) USB1.A3
RX1_P: length 26.6
  Top Layer w0.125: JMS583.26 25.1,16.05 arc(25.09,16.1) 25.06,16.14 arc(25.03,16.18) 25.02,16.23 arc(24.99,16.4) 24.89,16.55 24.41,17.03 arc(23.51,17.63) 22.44,17.84 21.95,17.84 arc(20.89,17.63) 19.98,17.03 18.83,15.87 arc(18.19,15.45) 17.44,15.3 13.23,15.3 arc(12.19,15.09) 11.3,14.5 arc(10.88,14.22) 10.39,14.12 8.5,14.12 arc(8.32,14.16) 8.17,14.26 8.05,14.38 arc(8.03,14.39) v1(8,14.4)
  Bottom Layer w0.125: v1(8,14.4) arc(7.97,14.39) 7.95,14.38 7.83,14.26 arc(7.68,14.16) 7.5,14.12 1.08,14.12 arc(0.99,14.16) USB1.A2
RX2_N: length 27.8
  Top Layer w0.125: JMS583.28 24.3,16.05 arc(24.29,16.1) 24.26,16.14 arc(24.23,16.18) 24.22,16.23 arc(24.19,16.4) 24.09,16.55 arc(23.21,17.14) 22.16,17.34 22.09,17.34 ; 22.06,17.34 arc(21.08,17.15) 20.25,16.59 19.2,15.54 arc(18.37,14.99) 17.4,14.8 13.54,14.8 arc(11.57,13.98) 10.75,12.02 10.75,11.9 arc(10.23,10.64) 8.98,10.12 1.08,10.12 arc(0.99,10.16) USB1.B3
RX2_P: length 27.4
  Top Layer w0.125: JMS583.29 23.9,16.05 arc(23.91,16.1) 23.94,16.14 arc(23.97,16.18) 23.98,16.23 arc(23.96,16.31) 23.92,16.37 arc(23.11,16.91) 22.16,17.1 22.08,17.1 arc(21.17,16.92) 20.41,16.41 19.37,15.37 arc(18.47,14.77) 17.4,14.56 13.54,14.56 arc(11.74,13.81) 11,12.02 11,11.8 arc(10.44,10.44) 9.08,9.88 1.08,9.88 arc(0.99,9.84) USB1.B2
TX1_N: length 10.9
  Top Layer w0.125: JMS583.22 26.7,16.05 arc(26.71,16.1) 26.74,16.14 arc(26.77,16.18) 26.78,16.23 26.78,16.4 arc(26.68,16.88) 26.41,17.29 25.73,17.97 ; 25.73,17.97 25.87,17.83 ; 25.73,17.97 25.27,18.43 arc(24.44,18.98) 23.47,19.18 18.7,19.18 arc(18.65,19.17) 18.61,19.14 arc(18.59,19.1) 18.58,19.05 18.58,19.01 arc(18.56,18.92) 18.51,18.84 18.46,18.79 arc(18.36,18.72) C6.2
TX1_P: length 11.1
  Top Layer w0.125: JMS583.21 27.1,16.05 arc(27.09,16.1) 27.06,16.14 arc(27.03,16.18) 27.02,16.23 27.02,16.4 arc(26.91,16.98) 26.58,17.47 25.44,18.61 arc(24.54,19.21) 23.47,19.42 18.7,19.42 arc(18.65,19.43) 18.61,19.46 arc(18.59,19.5) 18.58,19.55 18.58,19.59 arc(18.56,19.68) 18.51,19.76 18.46,19.81 arc(18.36,19.88) C7.2
TX2_N: length 10.4
  Top Layer w0.125: JMS583.23 26.3,16.05 arc(26.29,16.1) 26.26,16.14 arc(26.23,16.18) 26.22,16.23 26.22,16.4 arc(26.09,17.07) 25.71,17.64 25.37,17.97 arc(24.96,18.25) 24.48,18.34 21.7,18.34 arc(20.63,18.13) 19.73,17.53 19.52,17.32 arc(19.19,17.1) 18.8,17.02 18.7,17.02 arc(18.65,17.03) 18.61,17.06 arc(18.59,17.1) 18.58,17.15 18.58,17.19 arc(18.56,17.28) 18.51,17.36 18.46,17.41 arc(18.36,17.48) C11.2
TX2_P: length 10
  Top Layer w0.125: JMS583.24 25.9,16.05 arc(25.91,16.1) 25.94,16.14 arc(25.97,16.18) 25.98,16.23 25.98,16.4 arc(25.86,16.98) 25.54,17.46 25.2,17.8 arc(24.87,18.02) 24.48,18.1 21.7,18.1 arc(20.73,17.91) 19.9,17.36 19.69,17.15 arc(19.28,16.87) 18.8,16.78 18.7,16.78 arc(18.65,16.77) 18.61,16.74 arc(18.59,16.7) 18.58,16.65 18.58,16.61 arc(18.56,16.52) 18.51,16.44 18.46,16.39 arc(18.36,16.32) C10.2
U_CC1: length 9.4
  Top Layer w0.15: v1(3.9,8.5) 4.4,8 R12.1
  VCC w0.15: v1(3.4,13.3) 3.4,12.59 3.2,12.39 3.2,9.19 v1(3.9,8.5)
  Bottom Layer w0.15: v1(3.4,13.3) 3.32,13.3 2.77,12.75 USB1.A5
U_CC2: length 5.8
  Top Layer w0.15: R13.1 5.13,9.3 v1(4.3,9.3) ; v1(4,10.7) 3.92,10.78 3.12,10.78 2.63,11.27 1.87,11.27 1.85,11.25 USB1.B5
  VCC w0.15: v1(4.3,9.3) 4.3,9.41 4,9.71 v1(4,10.7)
U_TX1_N: length 20.2
  Top Layer w0.125: 11.2,19.18 16.7,19.18 arc(16.75,19.17) 16.79,19.14 arc(16.81,19.1) 16.82,19.05 16.82,19.01 arc(16.84,18.92) 16.89,18.84 16.94,18.79 arc(17.04,18.72) C6.1 ; 11.2,19.18 8.72,19.18 arc(7.18,18.54) 6.55,17 6.55,15.92 arc(5.95,14.48) 4.5,13.88 1.08,13.88 arc(0.99,13.84) USB1.B10 ; 11.2,19.18 11.4,19.18
U_TX1_P: length 20
  Top Layer w0.125: C7.1 arc(17.04,19.88) 16.94,19.81 16.89,19.76 arc(16.84,19.68) 16.82,19.59 16.82,19.55 arc(16.81,19.5) 16.79,19.46 arc(16.75,19.43) 16.7,19.42 8.72,19.42 arc(7.01,18.71) 6.3,17 6.3,15.92 arc(5.77,14.65) 4.5,14.12 1.08,14.12 arc(0.99,14.16) USB1.B11
U_TX2_N: length 21.7
  Top Layer w0.14: C11.1 arc(17.04,17.48) 16.94,17.41 16.9,17.37 arc(16.85,17.29) 16.83,17.21 16.83,17.17 arc(16.82,17.12) 16.79,17.07 arc(16.74,17.04) 16.69,17.03 9.44,17.03 arc(7.46,16.21) 6.64,14.23 6.64,13.2 arc(6.62,13.1) 6.57,13.02 6.46,12.91 arc(6.39,12.82) v1(6.37,12.7)
  Bottom Layer w0.14: v1(6.37,12.7) arc(6.38,12.66) 6.4,12.63 6.51,12.52 arc(6.61,12.37) 6.64,12.2 6.64,11.84 arc(6.14,10.63) 4.93,10.13 1.07,10.13 arc(0.99,10.17) USB1.A10
U_TX2_P: length 21.7
  Top Layer w0.14: C10.1 arc(17.04,16.32) 16.94,16.39 16.9,16.43 arc(16.85,16.51) 16.83,16.59 16.83,16.63 arc(16.82,16.68) 16.79,16.73 arc(16.74,16.76) 16.69,16.77 9.44,16.77 arc(7.64,16.03) 6.9,14.23 6.9,13.2 arc(6.92,13.1) 6.97,13.02 7.08,12.91 arc(7.15,12.81) v1(7.17,12.7)
  Bottom Layer w0.14: v1(7.17,12.7) arc(7.16,12.66) 7.14,12.63 7.03,12.52 arc(6.93,12.37) 6.9,12.2 6.9,11.84 arc(6.32,10.45) 4.93,9.87 1.07,9.87 arc(0.99,9.83) USB1.A11
XIN: length 9.4
  Top Layer w0.15: X1.1 19.5,2.95 20.5,3.95 20.5,5.4 20.8,5.7 22.1,5.7 23.08,6.67 23.08,7.78 JMS583.50
  Top Layer w0.2: C8.2 18.5,3.75 19.3,2.95 X1.1
XOUT: length 5.6
  Top Layer w0.15: X1.3 21.7,4.65 22.22,5.17 22.22,5.28 23.5,6.55 JMS583.51
  Top Layer w0.2: C2.2 23.2,4.82 23.03,4.65 21.7,4.65
$1N3363: length 1.5
  Bottom Layer w0.15: SSD_P.2 5.37,15.44 5.37,16.9
$1N3561: length 1.5
  Bottom Layer w0.15: R7.2 4.77,6.42 Work.1
$1N4495: length 2
  Top Layer w0.2: JMS583.39 20.94,12.4 arc(20.87,12.39) 20.81,12.37 v1(20.69,12.32)
  Bottom Layer w0.2: R5.1 20.39,12.2 arc(20.55,12.23) v1(20.69,12.32)
$1N10279: length 7.8
  Top Layer w0.2: C22.2 38.31,4.13 37.2,4.13 ; 37.2,4.13 37.3,4.23 37.3,4.6 38.3,5.6 38.3,8.05 38.85,8.6 U8.5 ; 37.2,4.13 36,4.13
$1N10953: length 1.5
  Bottom Layer w0.15: 5.37,21.4 5.37,19.94 Power.2
$1N11540: length 7.8
  Top Layer w0.2: R8.2 R10.1 ; R10.1 38.31,16.73 C21.2 ; R10.1 37.2,17.2 38.3,18.3 38.3,20.65 38.85,21.2 U7.5
$1N22897: length 3.5
  Top Layer w0.3: v1(31.3,20.4) 31.28,20.38 31.28,19.38 U9.1
  Bottom Layer w0.3: 29.7,19.15 29.82,19.27 29.82,19.72 30.44,20.34 31.24,20.34 v1(31.3,20.4)
$1N22946: length 4.7
  Top Layer w0.3: v1(31.5,18.3) 31.5,18.22 31.25,17.97 U9.5 U9.4
  Bottom Layer w0.3: R16.2 32.06,18.31 30.94,18.31 C56.1
$1N23051: length 21.1
  Top Layer w0.2: Q2.1 47.22,21.35 46.97,21.1 46.97,20.84 46.67,20.53 R15.2 v1(46.1,21.5) ; U9.3 29.35,19.61 30.66,20.92 32.08,20.92 v1(32.6,20.4)
  Bottom Layer w0.2: v1(46.1,21.5) 45,20.4 v1(32.6,20.4)

## Copper pours and planes (outline as drawn; the poured copper is in the pictures)
3V3 on Top Layer: 33.4,5 44,5 44,0.7 33.4,0.7
AVDDL on Top Layer: 36.9,17.6 44,17.6 44,13.8 36.9,13.8
AVDDL on Top Layer: 27.6,4.1 32.3,4.1 32.3,2.3 27.6,2.3
AVDDL on VCC: 29.8,3.8 31.2,3.8 31.2,2.8 29.8,2.8
GND on Top Layer: 0.17,9.25 1.78,9.25 1.78,6.2 0.17,6.2
GND on Top Layer: 2.5,0 0.73,0.73 0,2.5 0,21.5 0.73,23.27 2.5,24 97.5,24 99.27,23.27 100,21.5 100,2.5 99.27,0.73 97.5,0
GND on Top Layer: 0.17,17.9 1.78,17.9 1.78,14.75 0.17,14.75
GND on Top Layer: 39.5,20.6 44,20.6 44,17.8 39.5,17.8
GND on Top Layer: 39.5,8 44,8 44,5.2 39.5,5.2
GND on Bottom Layer: 2.5,0 0.73,0.73 0,2.5 0,21.5 0.73,23.27 2.5,24 97.5,24 99.27,23.27 100,21.5 100,2.5 99.27,0.73 97.5,0
GND on Bottom Layer: 0.17,9.25 1.78,9.25 1.78,6.2 0.17,6.2
GND on Bottom Layer: 0.17,17.9 1.78,17.9 1.78,14.75 0.17,14.75
GND on GND: 2.5,0 0.73,0.73 0,2.5 0,21.5 0.73,23.27 2.5,24 97.5,24 99.27,23.27 100,21.5 100,2.5 99.27,0.73 97.5,0
GND on VCC: 2.5,0 0.73,0.73 0,2.5 0,21.5 0.73,23.27 2.5,24 97.5,24 99.27,23.27 100,21.5 100,2.5 99.27,0.73 97.5,0
VBUS on Top Layer: 39.65,10.33 44.05,10.33 44.05,7.92 39.65,7.92
VBUS on Top Layer: 39.65,23 44.05,23 44.05,20.53 39.65,20.53
VBUS on Top Layer: 45.6,19.95 48.12,19.95 48.12,17.45 45.6,17.45
VBUS on Top Layer: 29.3,8.9 33.7,8.9 33.7,5.9 29.3,5.9
VBUS on Top Layer: 32,19.4 33.5,19.4 33.5,17.35 32,17.35
VBUS on Top Layer: 29.3,16.1 30.6,16.1 30.6,14.7 29.3,14.7
VBUS on VCC: 40.7,22.6 44.2,22.6 44.2,20.1 40.7,20.1
VCC on Top Layer: 27.25,18.35 28,18.35 28,15.8 27.25,15.8
LXO on Top Layer: 27.7,8.2 29.6,8.2 29.6,4.4 27.7,4.4
M.2_3V3 on Top Layer: 29.1,2.1 32.6,2.1 32.6,0.7 29.1,0.7
M.2_3V3 on Bottom Layer: 16.8,22.1 20.4,22.1 20.4,20.3 16.8,20.3
M.2_3V3 on Bottom Layer: 15.3,18.9 17.6,18.9 17.6,16.8 15.3,16.8
M.2_3V3 on Bottom Layer: 16.8,4.16 20.5,4.16 20.5,0.3 16.8,0.3
M.2_3V3 on VCC: 15,22.1 20.4,22.1 20.4,17.1 15,17.1
M.2_3V3 on VCC: 14.4,19.1 20.6,19.1 20.6,0.3 14.4,0.3
M.2_3V3 on VCC: 16.8,2.2 31.5,2.2 31.5,0.3 16.8,0.3
$1N10317 on Top Layer: 39.1,7.1 41.3,7.1 41.3,4.4 39.1,4.4
$1N11538 on Top Layer: 39.1,19.7 41.3,19.7 41.3,17 39.1,17
$1N23334 on Top Layer: 48.88,21.94 54.5,21.94 54.5,19 48.88,19

Small or netless copper shapes (teardrops, artwork), in the pictures only: 136 on Top Layer, 73 on Bottom Layer, 17 on VCC

## Text on the board
Bottom Silkscreen Layer: Designed By | 2230 | 2242 | 2280
Mechanical Layer: 13,5 | 45 | 50 | 30 | 57 | 62 | 42 | 100 | 95 | 80 | R2,5 | 19 | 24 | ∅4 | ∅2,05
